# Altium schematic sheet PreTriggerECAL.SchDoc
size A2
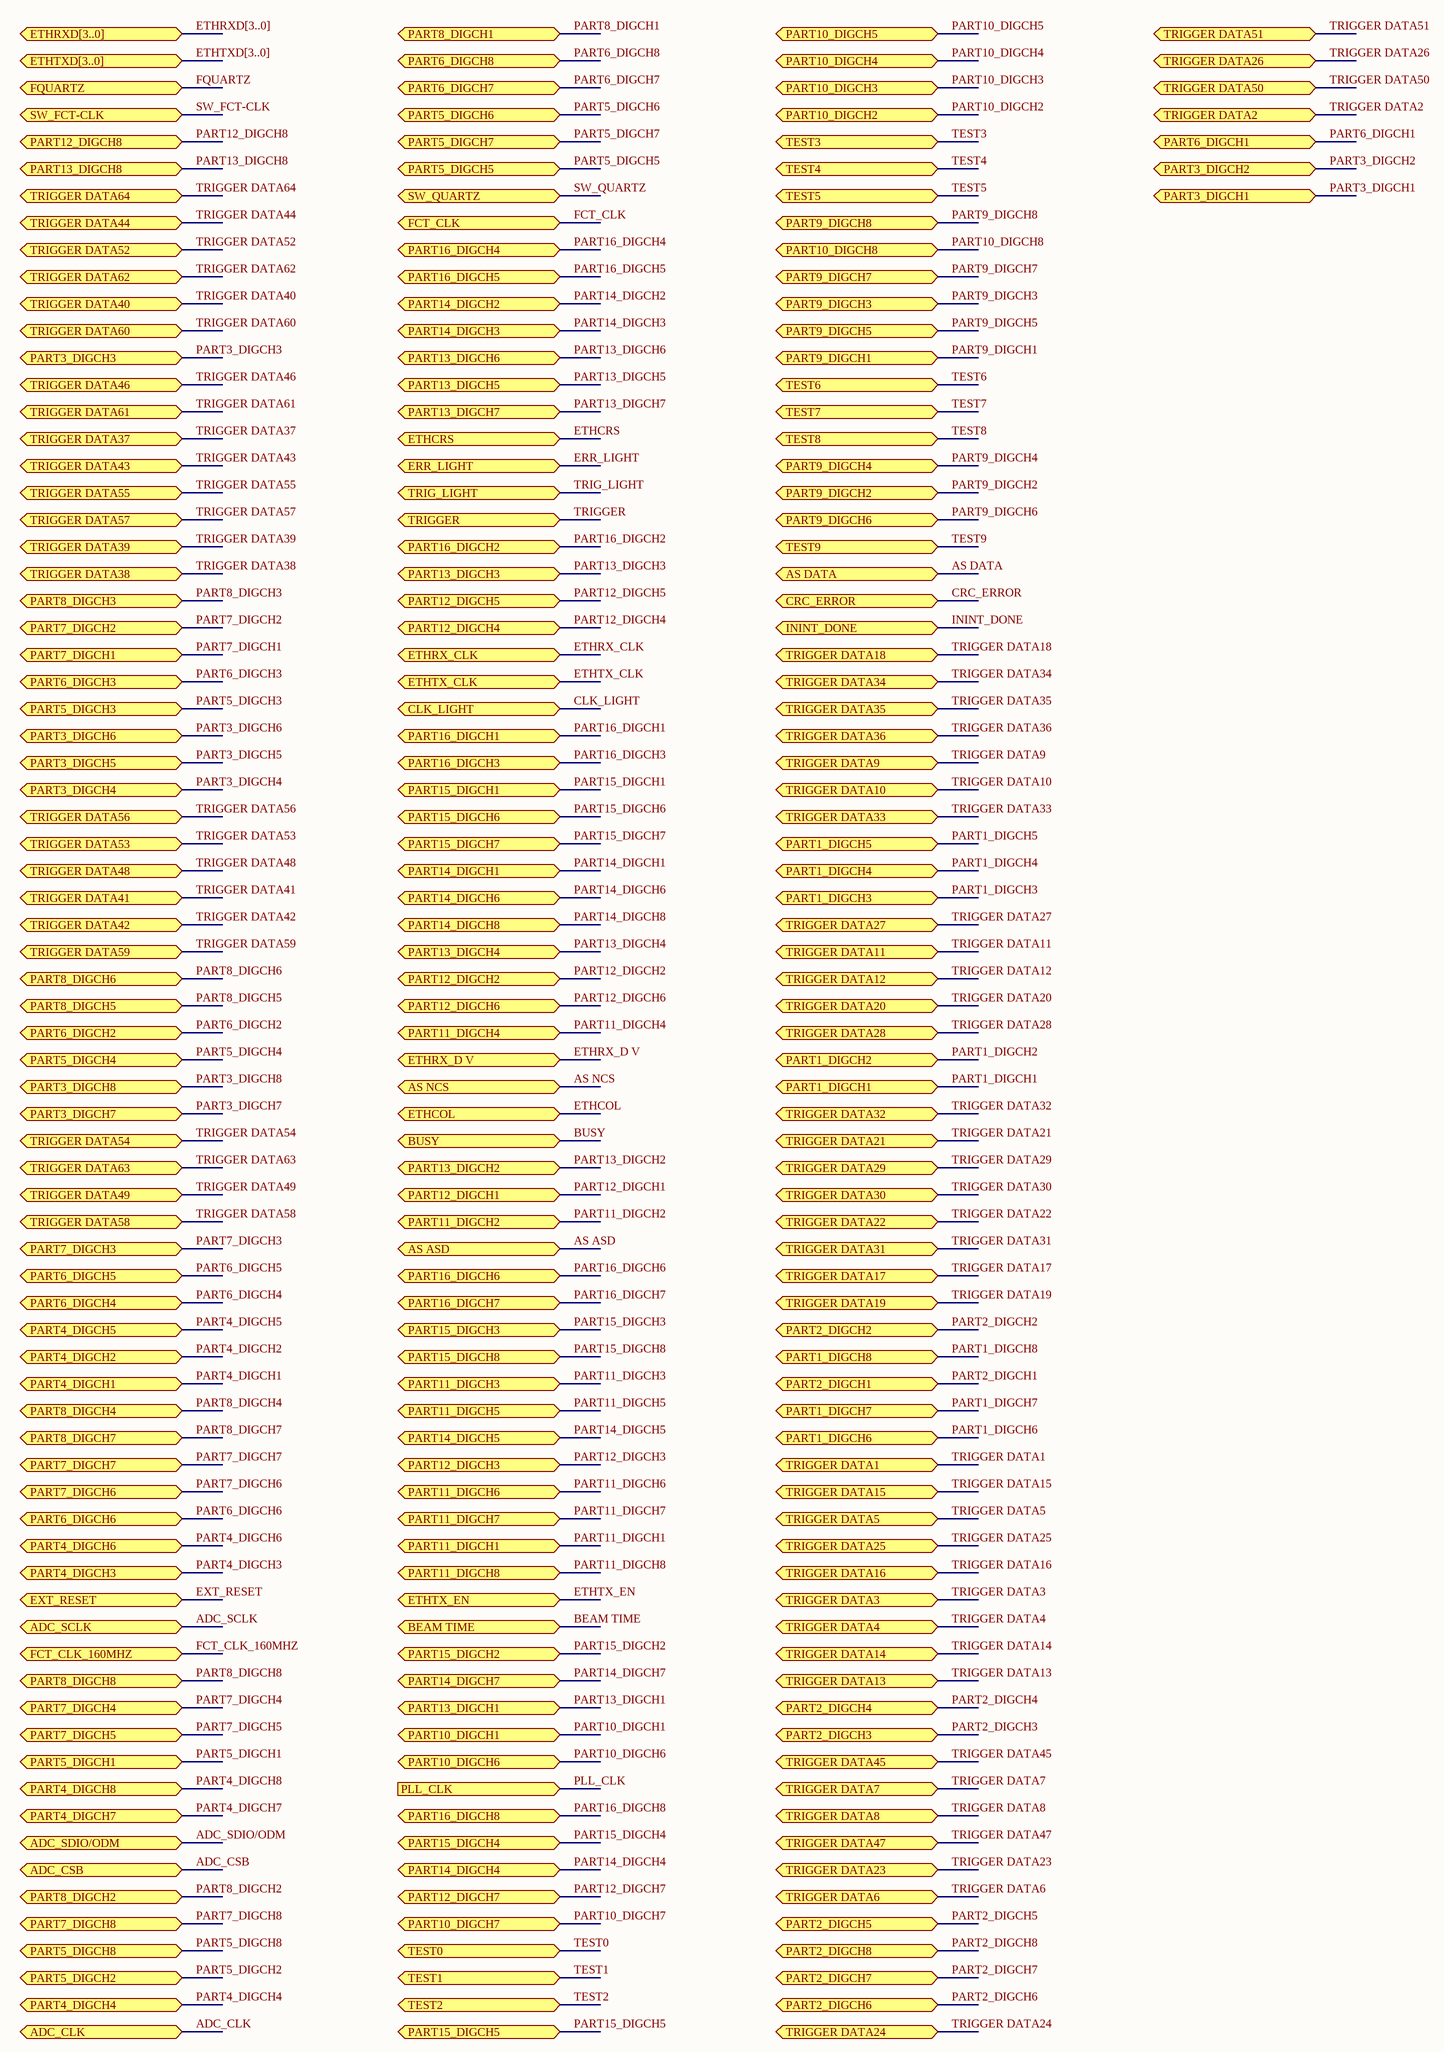
[diagram p0: PreTriggerECAL.SchDoc]

## Ports
ADC_CLK (bidir), ADC_CSB (bidir), ADC_SCLK (bidir), ADC_SDIO/ODM (bidir), AS ASD (bidir), AS DATA (bidir), AS NCS (bidir), BEAM TIME (bidir), BUSY (bidir), CLK_LIGHT (bidir), CRC_ERROR (bidir), ERR_LIGHT (bidir), ETHCOL (bidir), ETHCRS (bidir), ETHRX_CLK (bidir), ETHRX_D V (bidir), ETHRXD[3..0] (bidir), ETHTX_CLK (bidir), ETHTX_EN (bidir), ETHTXD[3..0] (bidir), EXT_RESET (bidir), FCT_CLK (bidir), FCT_CLK_160MHZ (bidir), FQUARTZ (bidir), ININT_DONE (bidir), PART1_DIGCH1 (bidir), PART1_DIGCH2 (bidir), PART1_DIGCH3 (bidir), PART1_DIGCH4 (bidir), PART1_DIGCH5 (bidir), PART1_DIGCH6 (bidir), PART1_DIGCH7 (bidir), PART1_DIGCH8 (bidir), PART2_DIGCH1 (bidir), PART2_DIGCH2 (bidir), PART2_DIGCH3 (bidir), PART2_DIGCH4 (bidir), PART2_DIGCH5 (bidir), PART2_DIGCH6 (bidir), PART2_DIGCH7 (bidir), PART2_DIGCH8 (bidir), PART3_DIGCH1 (bidir), PART3_DIGCH2 (bidir), PART3_DIGCH3 (bidir), PART3_DIGCH4 (bidir), PART3_DIGCH5 (bidir), PART3_DIGCH6 (bidir), PART3_DIGCH7 (bidir), PART3_DIGCH8 (bidir), PART4_DIGCH1 (bidir), PART4_DIGCH2 (bidir), PART4_DIGCH3 (bidir), PART4_DIGCH4 (bidir), PART4_DIGCH5 (bidir), PART4_DIGCH6 (bidir), PART4_DIGCH7 (bidir), PART4_DIGCH8 (bidir), PART5_DIGCH1 (bidir), PART5_DIGCH2 (bidir), PART5_DIGCH3 (bidir), PART5_DIGCH4 (bidir), PART5_DIGCH5 (bidir), PART5_DIGCH6 (bidir), PART5_DIGCH7 (bidir), PART5_DIGCH8 (bidir), PART6_DIGCH1 (bidir), PART6_DIGCH2 (bidir), PART6_DIGCH3 (bidir), PART6_DIGCH4 (bidir), PART6_DIGCH5 (bidir), PART6_DIGCH6 (bidir), PART6_DIGCH7 (bidir), PART6_DIGCH8 (bidir), PART7_DIGCH1 (bidir), PART7_DIGCH2 (bidir), PART7_DIGCH3 (bidir), PART7_DIGCH4 (bidir), PART7_DIGCH5 (bidir), PART7_DIGCH6 (bidir), PART7_DIGCH7 (bidir), PART7_DIGCH8 (bidir), PART8_DIGCH1 (bidir), PART8_DIGCH2 (bidir), PART8_DIGCH3 (bidir), PART8_DIGCH4 (bidir), PART8_DIGCH5 (bidir), PART8_DIGCH6 (bidir), PART8_DIGCH7 (bidir), PART8_DIGCH8 (bidir), PART9_DIGCH1 (bidir), PART9_DIGCH2 (bidir), PART9_DIGCH3 (bidir), PART9_DIGCH4 (bidir), PART9_DIGCH5 (bidir), PART9_DIGCH6 (bidir), PART9_DIGCH7 (bidir), PART9_DIGCH8 (bidir), PART10_DIGCH1 (bidir), PART10_DIGCH2 (bidir), PART10_DIGCH3 (bidir), PART10_DIGCH4 (bidir), PART10_DIGCH5 (bidir), PART10_DIGCH6 (bidir), PART10_DIGCH7 (bidir), PART10_DIGCH8 (bidir), PART11_DIGCH1 (bidir), PART11_DIGCH2 (bidir), PART11_DIGCH3 (bidir), PART11_DIGCH4 (bidir), PART11_DIGCH5 (bidir), PART11_DIGCH6 (bidir), PART11_DIGCH7 (bidir), PART11_DIGCH8 (bidir), PART12_DIGCH1 (bidir), PART12_DIGCH2 (bidir), PART12_DIGCH3 (bidir), PART12_DIGCH4 (bidir), PART12_DIGCH5 (bidir), PART12_DIGCH6 (bidir), PART12_DIGCH7 (bidir), PART12_DIGCH8 (bidir), PART13_DIGCH1 (bidir), PART13_DIGCH2 (bidir), PART13_DIGCH3 (bidir), PART13_DIGCH4 (bidir), PART13_DIGCH5 (bidir), PART13_DIGCH6 (bidir), PART13_DIGCH7 (bidir), PART13_DIGCH8 (bidir), PART14_DIGCH1 (bidir), PART14_DIGCH2 (bidir), PART14_DIGCH3 (bidir), PART14_DIGCH4 (bidir), PART14_DIGCH5 (bidir), PART14_DIGCH6 (bidir), PART14_DIGCH7 (bidir), PART14_DIGCH8 (bidir), PART15_DIGCH1 (bidir), PART15_DIGCH2 (bidir), PART15_DIGCH3 (bidir), PART15_DIGCH4 (bidir), PART15_DIGCH5 (bidir), PART15_DIGCH6 (bidir), PART15_DIGCH7 (bidir), PART15_DIGCH8 (bidir), PART16_DIGCH1 (bidir), PART16_DIGCH2 (bidir), PART16_DIGCH3 (bidir), PART16_DIGCH4 (bidir), PART16_DIGCH5 (bidir), PART16_DIGCH6 (bidir), PART16_DIGCH7 (bidir), PART16_DIGCH8 (bidir), PLL_CLK (in), SW_FCT-CLK (bidir), SW_QUARTZ (bidir), TEST0 (bidir), TEST1 (bidir), TEST2 (bidir), TEST3 (bidir), TEST4 (bidir), TEST5 (bidir), TEST6 (bidir), TEST7 (bidir), TEST8 (bidir), TEST9 (bidir), TRIG_LIGHT (bidir), TRIGGER (bidir), TRIGGER DATA1 (bidir), TRIGGER DATA2 (bidir), TRIGGER DATA3 (bidir), TRIGGER DATA4 (bidir), TRIGGER DATA5 (bidir), TRIGGER DATA6 (bidir), TRIGGER DATA7 (bidir), TRIGGER DATA8 (bidir), TRIGGER DATA9 (bidir), TRIGGER DATA10 (bidir), TRIGGER DATA11 (bidir), TRIGGER DATA12 (bidir), TRIGGER DATA13 (bidir), TRIGGER DATA14 (bidir), TRIGGER DATA15 (bidir), TRIGGER DATA16 (bidir), TRIGGER DATA17 (bidir), TRIGGER DATA18 (bidir), TRIGGER DATA19 (bidir), TRIGGER DATA20 (bidir), TRIGGER DATA21 (bidir), TRIGGER DATA22 (bidir), TRIGGER DATA23 (bidir), TRIGGER DATA24 (bidir), TRIGGER DATA25 (bidir), TRIGGER DATA26 (bidir), TRIGGER DATA27 (bidir), TRIGGER DATA28 (bidir), TRIGGER DATA29 (bidir), TRIGGER DATA30 (bidir), TRIGGER DATA31 (bidir), TRIGGER DATA32 (bidir), TRIGGER DATA33 (bidir), TRIGGER DATA34 (bidir), TRIGGER DATA35 (bidir), TRIGGER DATA36 (bidir), TRIGGER DATA37 (bidir), TRIGGER DATA38 (bidir), TRIGGER DATA39 (bidir), TRIGGER DATA40 (bidir), TRIGGER DATA41 (bidir), TRIGGER DATA42 (bidir), TRIGGER DATA43 (bidir), TRIGGER DATA44 (bidir), TRIGGER DATA45 (bidir), TRIGGER DATA46 (bidir), TRIGGER DATA47 (bidir), TRIGGER DATA48 (bidir), TRIGGER DATA49 (bidir), TRIGGER DATA50 (bidir), TRIGGER DATA51 (bidir), TRIGGER DATA52 (bidir), TRIGGER DATA53 (bidir), TRIGGER DATA54 (bidir), TRIGGER DATA55 (bidir), TRIGGER DATA56 (bidir), TRIGGER DATA57 (bidir), TRIGGER DATA58 (bidir), TRIGGER DATA59 (bidir), TRIGGER DATA60 (bidir), TRIGGER DATA61 (bidir), TRIGGER DATA62 (bidir), TRIGGER DATA63 (bidir), TRIGGER DATA64 (bidir)

## Nets
ADC_CLK: port ADC_CLK
ADC_CSB: port ADC_CSB
ADC_SCLK: port ADC_SCLK
ADC_SDIO/ODM: port ADC_SDIO/ODM
AS ASD: port AS ASD
AS DATA: port AS DATA
AS NCS: port AS NCS
BEAM TIME: port BEAM TIME
BUSY: port BUSY
CLK_LIGHT: port CLK_LIGHT
CRC_ERROR: port CRC_ERROR
ERR_LIGHT: port ERR_LIGHT
ETHCOL: port ETHCOL
ETHCRS: port ETHCRS
ETHRX_CLK: port ETHRX_CLK
ETHRX_D V: port ETHRX_D V
ETHTX_CLK: port ETHTX_CLK
ETHTX_EN: port ETHTX_EN
EXT_RESET: port EXT_RESET
FCT_CLK: port FCT_CLK
FCT_CLK_160MHZ: port FCT_CLK_160MHZ
FQUARTZ: port FQUARTZ
ININT_DONE: port ININT_DONE
PART1_DIGCH1: port PART1_DIGCH1
PART1_DIGCH2: port PART1_DIGCH2
PART1_DIGCH3: port PART1_DIGCH3
PART1_DIGCH4: port PART1_DIGCH4
PART1_DIGCH5: port PART1_DIGCH5
PART1_DIGCH6: port PART1_DIGCH6
PART1_DIGCH7: port PART1_DIGCH7
PART1_DIGCH8: port PART1_DIGCH8
PART2_DIGCH1: port PART2_DIGCH1
PART2_DIGCH2: port PART2_DIGCH2
PART2_DIGCH3: port PART2_DIGCH3
PART2_DIGCH4: port PART2_DIGCH4
PART2_DIGCH5: port PART2_DIGCH5
PART2_DIGCH6: port PART2_DIGCH6
PART2_DIGCH7: port PART2_DIGCH7
PART2_DIGCH8: port PART2_DIGCH8
PART3_DIGCH1: port PART3_DIGCH1
PART3_DIGCH2: port PART3_DIGCH2
PART3_DIGCH3: port PART3_DIGCH3
PART3_DIGCH4: port PART3_DIGCH4
PART3_DIGCH5: port PART3_DIGCH5
PART3_DIGCH6: port PART3_DIGCH6
PART3_DIGCH7: port PART3_DIGCH7
PART3_DIGCH8: port PART3_DIGCH8
PART4_DIGCH1: port PART4_DIGCH1
PART4_DIGCH2: port PART4_DIGCH2
PART4_DIGCH3: port PART4_DIGCH3
PART4_DIGCH4: port PART4_DIGCH4
PART4_DIGCH5: port PART4_DIGCH5
PART4_DIGCH6: port PART4_DIGCH6
PART4_DIGCH7: port PART4_DIGCH7
PART4_DIGCH8: port PART4_DIGCH8
PART5_DIGCH1: port PART5_DIGCH1
PART5_DIGCH2: port PART5_DIGCH2
PART5_DIGCH3: port PART5_DIGCH3
PART5_DIGCH4: port PART5_DIGCH4
PART5_DIGCH5: port PART5_DIGCH5
PART5_DIGCH6: port PART5_DIGCH6
PART5_DIGCH7: port PART5_DIGCH7
PART5_DIGCH8: port PART5_DIGCH8
PART6_DIGCH1: port PART6_DIGCH1
PART6_DIGCH2: port PART6_DIGCH2
PART6_DIGCH3: port PART6_DIGCH3
PART6_DIGCH4: port PART6_DIGCH4
PART6_DIGCH5: port PART6_DIGCH5
PART6_DIGCH6: port PART6_DIGCH6
PART6_DIGCH7: port PART6_DIGCH7
PART6_DIGCH8: port PART6_DIGCH8
PART7_DIGCH1: port PART7_DIGCH1
PART7_DIGCH2: port PART7_DIGCH2
PART7_DIGCH3: port PART7_DIGCH3
PART7_DIGCH4: port PART7_DIGCH4
PART7_DIGCH5: port PART7_DIGCH5
PART7_DIGCH6: port PART7_DIGCH6
PART7_DIGCH7: port PART7_DIGCH7
PART7_DIGCH8: port PART7_DIGCH8
PART8_DIGCH1: port PART8_DIGCH1
PART8_DIGCH2: port PART8_DIGCH2
PART8_DIGCH3: port PART8_DIGCH3
PART8_DIGCH4: port PART8_DIGCH4
PART8_DIGCH5: port PART8_DIGCH5
PART8_DIGCH6: port PART8_DIGCH6
PART8_DIGCH7: port PART8_DIGCH7
PART8_DIGCH8: port PART8_DIGCH8
PART9_DIGCH1: port PART9_DIGCH1
PART9_DIGCH2: port PART9_DIGCH2
PART9_DIGCH3: port PART9_DIGCH3
PART9_DIGCH4: port PART9_DIGCH4
PART9_DIGCH5: port PART9_DIGCH5
PART9_DIGCH6: port PART9_DIGCH6
PART9_DIGCH7: port PART9_DIGCH7
PART9_DIGCH8: port PART9_DIGCH8
PART10_DIGCH1: port PART10_DIGCH1
PART10_DIGCH2: port PART10_DIGCH2
PART10_DIGCH3: port PART10_DIGCH3
PART10_DIGCH4: port PART10_DIGCH4
PART10_DIGCH5: port PART10_DIGCH5
PART10_DIGCH6: port PART10_DIGCH6
PART10_DIGCH7: port PART10_DIGCH7
PART10_DIGCH8: port PART10_DIGCH8
PART11_DIGCH1: port PART11_DIGCH1
PART11_DIGCH2: port PART11_DIGCH2
PART11_DIGCH3: port PART11_DIGCH3
PART11_DIGCH4: port PART11_DIGCH4
PART11_DIGCH5: port PART11_DIGCH5
PART11_DIGCH6: port PART11_DIGCH6
PART11_DIGCH7: port PART11_DIGCH7
PART11_DIGCH8: port PART11_DIGCH8
PART12_DIGCH1: port PART12_DIGCH1
PART12_DIGCH2: port PART12_DIGCH2
PART12_DIGCH3: port PART12_DIGCH3
PART12_DIGCH4: port PART12_DIGCH4
PART12_DIGCH5: port PART12_DIGCH5
PART12_DIGCH6: port PART12_DIGCH6
PART12_DIGCH7: port PART12_DIGCH7
PART12_DIGCH8: port PART12_DIGCH8
PART13_DIGCH1: port PART13_DIGCH1
PART13_DIGCH2: port PART13_DIGCH2
PART13_DIGCH3: port PART13_DIGCH3
PART13_DIGCH4: port PART13_DIGCH4
PART13_DIGCH5: port PART13_DIGCH5
PART13_DIGCH6: port PART13_DIGCH6
PART13_DIGCH7: port PART13_DIGCH7
PART13_DIGCH8: port PART13_DIGCH8
PART14_DIGCH1: port PART14_DIGCH1
PART14_DIGCH2: port PART14_DIGCH2
PART14_DIGCH3: port PART14_DIGCH3
PART14_DIGCH4: port PART14_DIGCH4
PART14_DIGCH5: port PART14_DIGCH5
PART14_DIGCH6: port PART14_DIGCH6
PART14_DIGCH7: port PART14_DIGCH7
PART14_DIGCH8: port PART14_DIGCH8
PART15_DIGCH1: port PART15_DIGCH1
PART15_DIGCH2: port PART15_DIGCH2
PART15_DIGCH3: port PART15_DIGCH3
PART15_DIGCH4: port PART15_DIGCH4
PART15_DIGCH5: port PART15_DIGCH5
PART15_DIGCH6: port PART15_DIGCH6
PART15_DIGCH7: port PART15_DIGCH7
PART15_DIGCH8: port PART15_DIGCH8
PART16_DIGCH1: port PART16_DIGCH1
PART16_DIGCH2: port PART16_DIGCH2
PART16_DIGCH3: port PART16_DIGCH3
PART16_DIGCH4: port PART16_DIGCH4
PART16_DIGCH5: port PART16_DIGCH5
PART16_DIGCH6: port PART16_DIGCH6
PART16_DIGCH7: port PART16_DIGCH7
PART16_DIGCH8: port PART16_DIGCH8
PLL_CLK: port PLL_CLK
SW_FCT-CLK: port SW_FCT-CLK
SW_QUARTZ: port SW_QUARTZ
TEST0: port TEST0
TEST1: port TEST1
TEST2: port TEST2
TEST3: port TEST3
TEST4: port TEST4
TEST5: port TEST5
TEST6: port TEST6
TEST7: port TEST7
TEST8: port TEST8
TEST9: port TEST9
TRIG_LIGHT: port TRIG_LIGHT
TRIGGER: port TRIGGER
TRIGGER DATA1: port TRIGGER DATA1
TRIGGER DATA2: port TRIGGER DATA2
TRIGGER DATA3: port TRIGGER DATA3
TRIGGER DATA4: port TRIGGER DATA4
TRIGGER DATA5: port TRIGGER DATA5
TRIGGER DATA6: port TRIGGER DATA6
TRIGGER DATA7: port TRIGGER DATA7
TRIGGER DATA8: port TRIGGER DATA8
TRIGGER DATA9: port TRIGGER DATA9
TRIGGER DATA10: port TRIGGER DATA10
TRIGGER DATA11: port TRIGGER DATA11
TRIGGER DATA12: port TRIGGER DATA12
TRIGGER DATA13: port TRIGGER DATA13
TRIGGER DATA14: port TRIGGER DATA14
TRIGGER DATA15: port TRIGGER DATA15
TRIGGER DATA16: port TRIGGER DATA16
TRIGGER DATA17: port TRIGGER DATA17
TRIGGER DATA18: port TRIGGER DATA18
TRIGGER DATA19: port TRIGGER DATA19
TRIGGER DATA20: port TRIGGER DATA20
TRIGGER DATA21: port TRIGGER DATA21
TRIGGER DATA22: port TRIGGER DATA22
TRIGGER DATA23: port TRIGGER DATA23
TRIGGER DATA24: port TRIGGER DATA24
TRIGGER DATA25: port TRIGGER DATA25
TRIGGER DATA26: port TRIGGER DATA26
TRIGGER DATA27: port TRIGGER DATA27
TRIGGER DATA28: port TRIGGER DATA28
TRIGGER DATA29: port TRIGGER DATA29
TRIGGER DATA30: port TRIGGER DATA30
TRIGGER DATA31: port TRIGGER DATA31
TRIGGER DATA32: port TRIGGER DATA32
TRIGGER DATA33: port TRIGGER DATA33
TRIGGER DATA34: port TRIGGER DATA34
TRIGGER DATA35: port TRIGGER DATA35
TRIGGER DATA36: port TRIGGER DATA36
TRIGGER DATA37: port TRIGGER DATA37
TRIGGER DATA38: port TRIGGER DATA38
TRIGGER DATA39: port TRIGGER DATA39
TRIGGER DATA40: port TRIGGER DATA40
TRIGGER DATA41: port TRIGGER DATA41
TRIGGER DATA42: port TRIGGER DATA42
TRIGGER DATA43: port TRIGGER DATA43
TRIGGER DATA44: port TRIGGER DATA44
TRIGGER DATA45: port TRIGGER DATA45
TRIGGER DATA46: port TRIGGER DATA46
TRIGGER DATA47: port TRIGGER DATA47
TRIGGER DATA48: port TRIGGER DATA48
TRIGGER DATA49: port TRIGGER DATA49
TRIGGER DATA50: port TRIGGER DATA50
TRIGGER DATA51: port TRIGGER DATA51
TRIGGER DATA52: port TRIGGER DATA52
TRIGGER DATA53: port TRIGGER DATA53
TRIGGER DATA54: port TRIGGER DATA54
TRIGGER DATA55: port TRIGGER DATA55
TRIGGER DATA56: port TRIGGER DATA56
TRIGGER DATA57: port TRIGGER DATA57
TRIGGER DATA58: port TRIGGER DATA58
TRIGGER DATA59: port TRIGGER DATA59
TRIGGER DATA60: port TRIGGER DATA60
TRIGGER DATA61: port TRIGGER DATA61
TRIGGER DATA62: port TRIGGER DATA62
TRIGGER DATA63: port TRIGGER DATA63
TRIGGER DATA64: port TRIGGER DATA64

## Buses and harness runs
bus ETHRXD[3..0] = port ETHRXD[3..0]
bus ETHTXD[3..0] = port ETHTXD[3..0]